# EAGLE board Embedded (EAGLE 9.2.1)
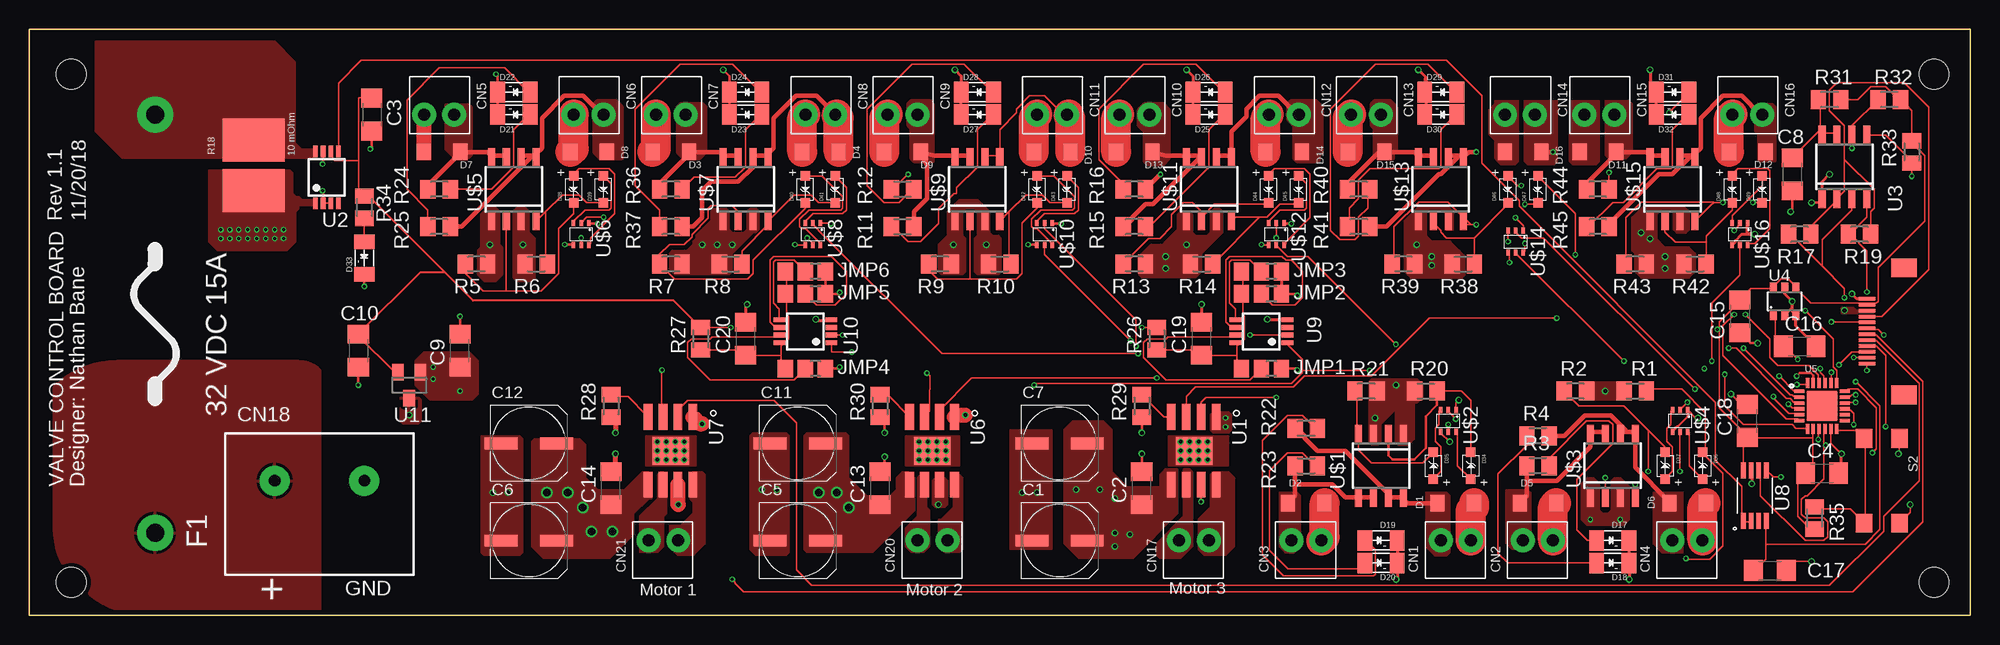
[diagram p2: board, top side]
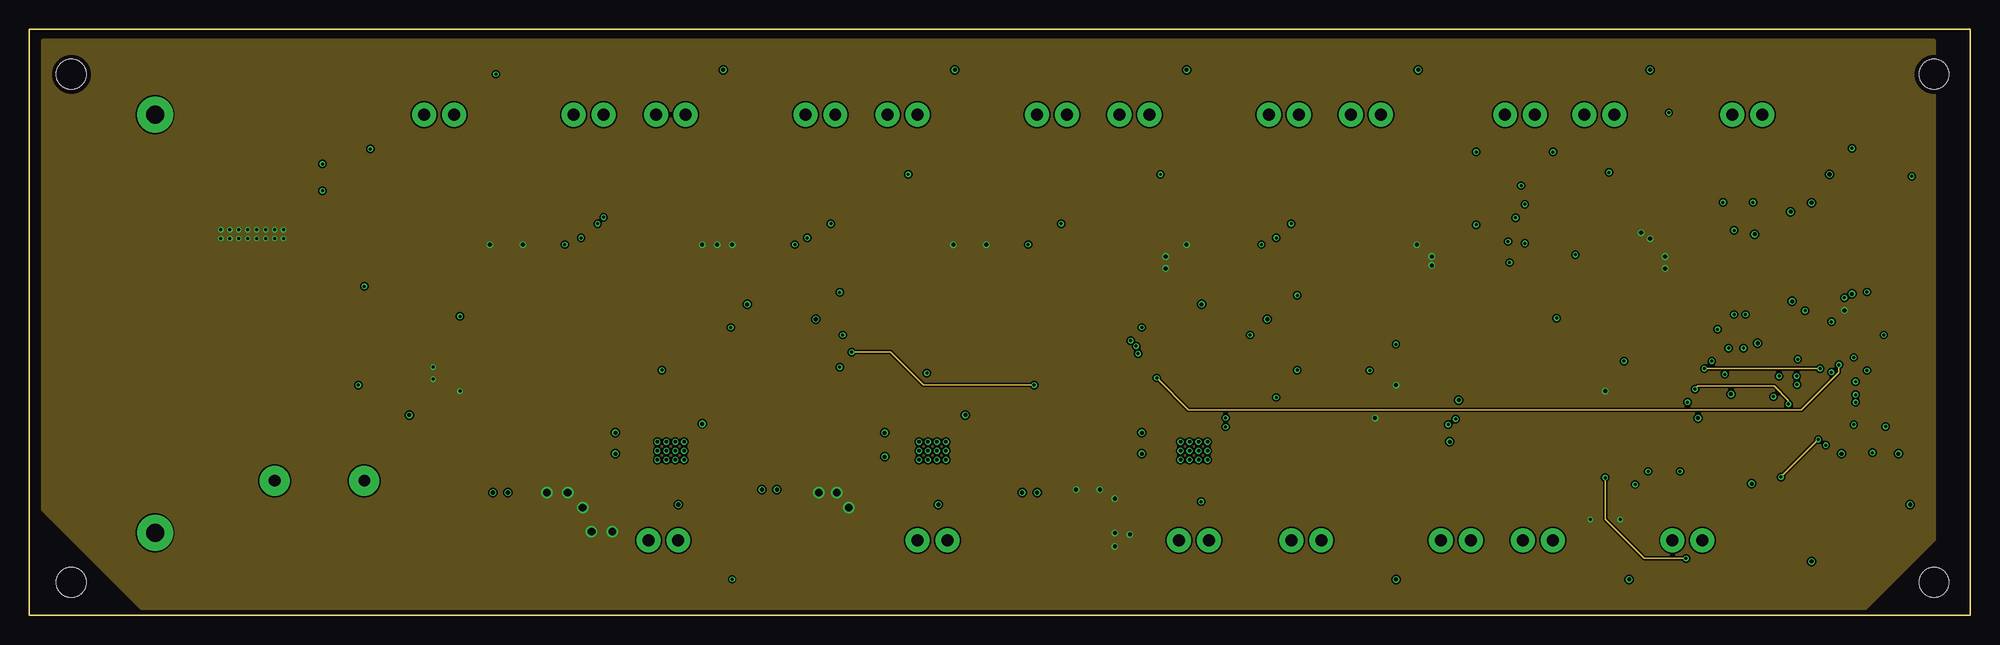
[diagram p3: board, inner layer Route2]
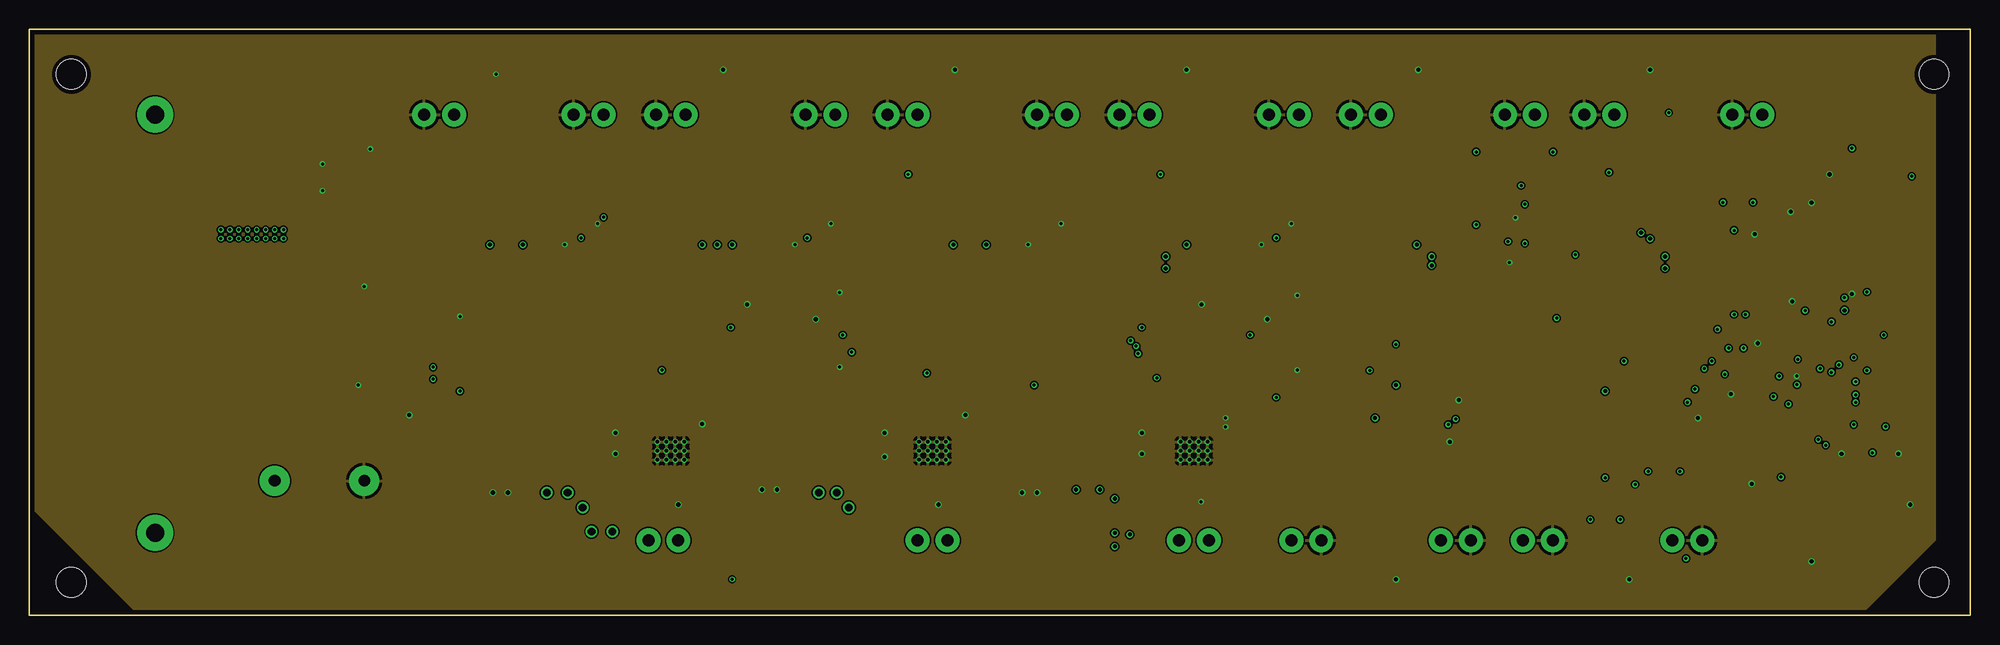
[diagram p4: board, inner layer Route15]
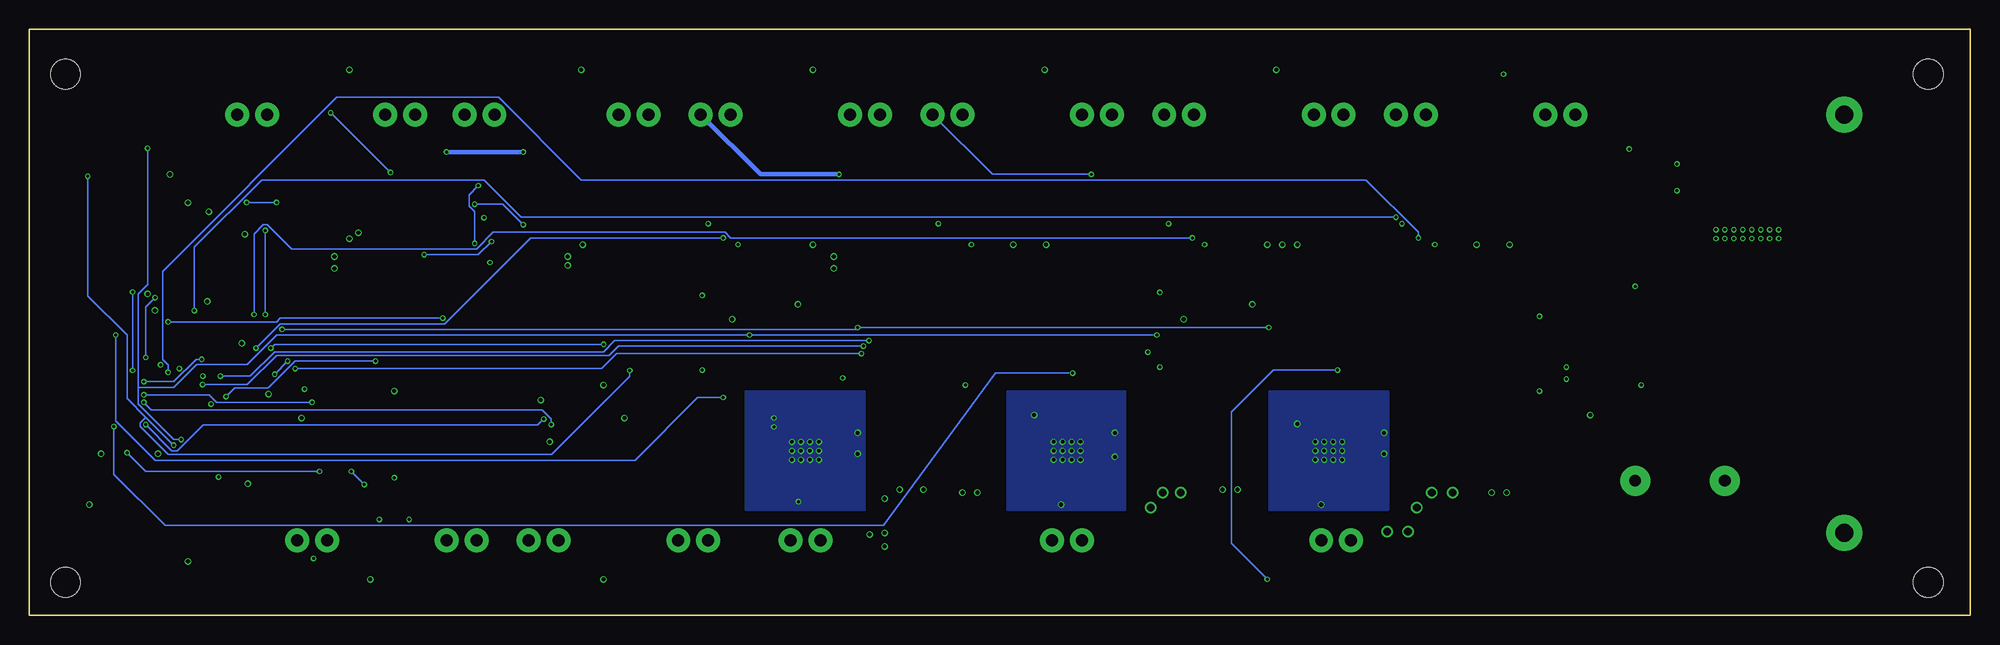
[diagram p5: board, bottom side, seen from below]

Size 164.85 x 49.78 mm. Coordinates in mm from the lower left corner, seen from the top.
Outline: 0,49.78 0,0 164.85,0 164.85,49.78 0,49.78
Copper layers (1*2*15*16): Top 0.035559375mm / dielectric 0.17018125mm / Route2 0.01778125mm / dielectric 47mil / Route15 0.01778125mm / dielectric 0.17018125mm / Bottom 0.035559375mm
Design rules "oshpark-4layer": minimum track width 5mil, minimum drill 10mil, track to track 5mil, track to pad 5mil, pad to pad 5mil, via to via 5mil, smd to smd 5mil, copper to edge 15mil, drill to drill 6mil, minimum pad ring 4mil, minimum via ring 4mil, stop-mask expansion 2.5mil, vias tented up to drill 0mil, thermal gap 10mil
Net classes: 1 GND: width 2.54 mm; 2 12V_OUT: width 2.54 mm, clearance 0.127 mm; 3 5V: width 0.127 mm, clearance 0.013 mm; 4 out: width 0.381 mm
Holes 2.5 mm at 161.8,2.79 161.8,45.97 3.56,2.79 3.56,45.97

## Footprints (pad centres in the part's own frame; a part is rotated, then mirrored left to right if it is on the bottom)
UD-6,3X7,7_NICHICON = smd 2.8 x 1: + 2.35,0; - -2.35,0
C1206 = smd 1.6 x 1.8: 1 -1.4,0; 2 1.4,0
KF2540-2 = drill 1.016 pad 2.032: P$1 0,1.27; P$2 0,-1.27
PHOEN_MKDS = drill 1 pad 2.54: P$1 -3.81,0; P$2 3.81,0
MOLEX_WM1108 = smd 0.3 x 1.4: P$1 -2.75,0; P$2 -2.25,0; P$3 -1.75,0; P$4 -1.25,0; P$5 -0.75,0; P$6 -0.25,0; P$7 0.25,0; P$8 0.75,0; P$9 1.25,0; P$10 1.75,0; P$11 2.25,0; P$12 2.75,0 | smd 1.6 x 2.2: P$13 -5.4,-3.15; P$14 5.4,-3.15
DO219 = smd 1.2 x 1.4: A$2 1.55,0; C$1 -1.55,0
1206 = smd 1.25 x 1.75: P$1 1.375,0; P$2 -1.375,0
SOD_323F = smd 0.8 x 0.8: A 1.15,0; C -1.15,0
LITTLEFUSE125_003 = drill 1.524 pad 3.048: P$1 17.78,0; P$2 -17.78,0
A0R-JMP = smd 1.5 x 1.3: 1 0,1.7; 2 0,0; 3 0,-1.7
M0805 = smd 1.3 x 1.6: 1 -0.95,0; 2 0.95,0
2818 = smd 3.65 x 5.25: P$1 -2.16,0; P$2 2.16,0
TL3305 = smd 1.6 x 1.4: P$1 -3.6,-1.5; P$2 3.6,-1.5; P$3 -3.6,1.5; P$4 3.6,1.5
SO8_EP = smd 2.4 x 3.1: GND 0,0 | smd 2.2 x 0.75: P1 -2.875,1.87; P2 -2.875,0.6; P3 -2.875,-0.67; P4 -2.875,-1.94; P5 2.876,-1.94; P6 2.875,-0.67; P7 2.875,0.6; P8 2.875,1.87 | drill 0.3 pad 0.406: P$1 -0.762,1.143; P$2 0,1.143; P$3 0.762,1.143; P$4 0.762,0.381; P$5 0,0.381; P$6 -0.762,0.381; P$7 -0.762,-0.381; P$8 0,-0.381; P$9 0.762,-0.381; P$10 0.762,-1.143; P$11 0,-1.143; P$12 -0.762,-1.143
DGK_S-PDSO-G8 = smd 0.4 x 1: 1 -0.975,-2.2; 2 -0.325,-2.2; 3 0.325,-2.2; 4 0.975,-2.2; 5 0.975,2.2; 6 0.325,2.2; 7 -0.325,2.2; 8 -0.975,2.2
SO-8 = smd 0.6 x 1.52: 1 -1.905,-2.725; 2 -0.635,-2.725; 3 0.635,-2.725; 4 1.905,-2.725; 5 1.905,2.725; 6 0.635,2.725; 7 -0.635,2.725; 8 -1.905,2.725
SOT23-6 = smd 0.6 x 0.9: 1 -0.95,-1.15; 2 0,-1.15; 3 0.95,-1.15; 4 0.95,1.15; 5 0,1.15; 6 -0.95,1.15
QFN_24_EP = smd 2.6 x 2.6: EP$1 0,0 | smd 0.85 x 0.3: P1 -1.95,1.25; P2 -1.95,0.75; P3 -1.95,0.25; P4 -1.95,-0.25; P5 -1.95,-0.75; P6 -1.95,-1.25; P13 1.95,-1.25; P14 1.95,-0.75; P15 1.95,-0.25; P16 1.95,0.25; P17 1.95,0.75; P18 1.95,1.25 | smd 0.3 x 0.85: P7 -1.25,-1.95; P8 -0.75,-1.95; P9 -0.25,-1.95; P10 0.25,-1.95; P11 0.75,-1.95; P12 1.25,-1.95; P19 1.25,1.95; P20 0.75,1.95; P21 0.25,1.95; P22 -0.25,1.95; P23 -0.75,1.95; P24 -1.25,1.95
UMAX8 = smd 1.35 x 0.4: P$1 -2.15,0.975; P$2 -2.15,0.325; P$3 -2.15,-0.325; P$4 -2.15,-0.975; P$5 2.15,-0.975; P$6 2.15,-0.325; P$7 2.15,0.325; P$8 2.15,0.975
SOT23 = smd 1 x 1.4: 1 -0.95,-1.1; 2 0.95,-1.1; 3 0,1.1
UMT6 = smd 0.5 x 0.3: 1 -0.925,0.65; 2 -0.925,0; 3 -0.925,-0.65; 4 0.925,-0.65; 5 0.925,0; 6 0.925,0.65

## Placement (x,y rotation side)
C1  47uF  [UD-6,3X7,7_NICHICON]  87.5,6.35 0 top
C2  1uF  [C1206]  94.49,10.79 90 top
C3  1uF  [C1206]  29.08,42.55 270 top
C4  1uF  [C1206]  152.27,12.06 0 top
C5  47uF  [UD-6,3X7,7_NICHICON]  65.28,6.35 0 top
C6  47uF  [UD-6,3X7,7_NICHICON]  42.42,6.35 0 top
C7  47uF  [UD-6,3X7,7_NICHICON]  87.5,14.61 0 top
C8  1uF  [C1206]  149.73,37.47 270 top
C9  1 uF  [C1206]  36.58,22.48 90 top
C10  .5 uF  [C1206]  27.94,22.48 270 top
C11  47uF  [UD-6,3X7,7_NICHICON]  65.28,14.61 0 top
C12  47uF  [UD-6,3X7,7_NICHICON]  42.42,14.61 0 top
C13  1uF  [C1206]  72.26,10.79 90 top
C14  1uF  [C1206]  49.4,10.79 90 top
C15  1uF  [C1206]  145.29,25.4 270 top
C16  .5uF  [C1206]  150.37,22.86 0 top
C17  1uF  [C1206]  147.83,3.81 0 top
C18  1uF  [C1206]  145.92,16.51 90 top
C19  1uF  [C1206]  99.57,23.5 90 top
C20  1uF  [C1206]  60.83,23.5 90 top
CN1  KF2510-2  [KF2540-2]  121.16,6.35 90 top
CN2  KF2510-2  [KF2540-2]  128.14,6.35 90 top
CN3  KF2510-2  [KF2540-2]  108.46,6.35 90 top
CN4  KF2510-2  [KF2540-2]  140.84,6.35 90 top
CN5  KF2510-2  [KF2540-2]  34.8,42.55 270 top
CN6  KF2510-2  [KF2540-2]  47.5,42.55 270 top
CN7  KF2510-2  [KF2540-2]  54.48,42.55 270 top
CN8  KF2510-2  [KF2540-2]  67.18,42.55 270 top
CN9  KF2510-2  [KF2540-2]  74.17,42.55 270 top
CN10  KF2510-2  [KF2540-2]  93.85,42.55 270 top
CN11  KF2510-2  [KF2540-2]  86.87,42.55 270 top
CN12  KF2510-2  [KF2540-2]  106.55,42.55 270 top
CN13  KF2510-2  [KF2540-2]  113.54,42.55 270 top
CN14  KF2510-2  [KF2540-2]  126.62,42.55 270 top
CN15  KF2510-2  [KF2540-2]  133.35,42.55 270 top
CN16  KF2510-2  [KF2540-2]  145.92,42.55 270 top
CN17  KF2510-2  [KF2540-2]  98.93,6.35 90 top
CN18  PHEON_MKDS_CON  [PHOEN_MKDS]  24.64,11.43 0 top
CN19  MOLEX_FPC_52892_1233  [MOLEX_WM1108]  156.08,24.13 90 top
CN20  KF2510-2  [KF2540-2]  76.71,6.35 90 top
CN21  KF2510-2  [KF2540-2]  53.85,6.35 90 top
D1  RS1AL_DIODE  [DO219]  121.16,9.53 0 top
D2  RS1AL_DIODE  [DO219]  108.46,9.53 0 top
D3  RS1AL_DIODE  [DO219]  54.48,39.37 180 top
D4  RS1AL_DIODE  [DO219]  67.18,39.37 180 top
D5  RS1AL_DIODE  [DO219]  128.14,9.53 0 top
D6  RS1AL_DIODE  [DO219]  140.84,9.53 0 top
D7  RS1AL_DIODE  [DO219]  35.05,39.37 180 top
D8  RS1AL_DIODE  [DO219]  47.5,39.37 180 top
D9  RS1AL_DIODE  [DO219]  74.17,39.37 180 top
D10  RS1AL_DIODE  [DO219]  86.87,39.37 180 top
D11  RS1AL_DIODE  [DO219]  133.22,39.37 180 top
D12  RS1AL_DIODE  [DO219]  145.92,39.37 180 top
D13  RS1AL_DIODE  [DO219]  93.85,39.37 180 top
D14  RS1AL_DIODE  [DO219]  106.55,39.37 180 top
D15  RS1AL_DIODE  [DO219]  113.54,39.37 180 top
D16  RS1AL_DIODE  [DO219]  126.87,39.37 180 top
D17  1206LED  [1206]  134.49,6.35 180 top
D18  1206LED  [1206]  134.49,4.45 180 top
D19  1206LED  [1206]  114.81,6.35 180 top
D20  1206LED  [1206]  114.81,4.45 180 top
D21  1206LED  [1206]  41.15,42.55 0 top
D22  1206LED  [1206]  41.15,44.45 0 top
D23  1206LED  [1206]  60.83,42.55 0 top
D24  1206LED  [1206]  60.83,44.45 0 top
D25  1206LED  [1206]  100.2,42.55 0 top
D26  1206LED  [1206]  100.2,44.45 0 top
D27  1206LED  [1206]  80.52,42.55 0 top
D28  1206LED  [1206]  80.52,44.45 0 top
D29  1206LED  [1206]  119.89,44.45 0 top
D30  1206LED  [1206]  119.89,42.55 0 top
D31  1206LED  [1206]  139.57,44.45 0 top
D32  1206LED  [1206]  139.57,42.55 0 top
D33  1206LED  [1206]  28.45,30.35 90 top
D34  6.2V  [SOD_323F]  122.43,12.7 270 top
D35  6.2V  [SOD_323F]  119.25,12.7 270 top
D36  6.2  [SOD_323F]  142.11,12.7 270 top
D37  6.2V  [SOD_323F]  138.94,12.7 270 top
D38  6.2V  [SOD_323F]  46.23,36.2 90 top
D39  6.2V  [SOD_323F]  48.77,36.2 90 top
D40  6.2V  [SOD_323F]  65.91,36.2 90 top
D41  6.2V  [SOD_323F]  68.45,36.2 90 top
D42  6.2V  [SOD_323F]  85.6,36.2 90 top
D43  6.2V  [SOD_323F]  88.14,36.2 90 top
D44  6.2V  [SOD_323F]  105.28,36.2 90 top
D45  6.2V  [SOD_323F]  107.82,36.2 90 top
D46  6.2V  [SOD_323F]  125.6,36.2 90 top
D47  6.2V  [SOD_323F]  128.14,36.2 90 top
D48  6.2V  [SOD_323F]  144.65,36.2 90 top
D49  6.2V  [SOD_323F]  147.19,36.2 90 top
F1  32 VDC 15A  [LITTLEFUSE125_003]  10.67,24.77 90 top
JMP1  0R-JUMPA  [A0R-JMP]  104.65,20.95 270 top
JMP2  0R-JUMPA  [A0R-JMP]  104.65,27.3 270 top
JMP3  0R-JUMPA  [A0R-JMP]  104.65,29.21 270 top
JMP4  0R-JUMPA  [A0R-JMP]  65.91,20.95 270 top
JMP5  0R-JUMPA  [A0R-JMP]  65.91,27.3 270 top
JMP6  0R-JUMPA  [A0R-JMP]  65.91,29.21 270 top
R1  5k  [M0805]  136.4,19.05 180 top
R2  5k  [M0805]  131.32,19.05 0 top
R3  5k  [M0805]  128.14,12.7 0 top
R4  5k  [M0805]  128.14,15.24 0 top
R5  5k  [M0805]  37.97,29.84 0 top
R6  1k  [M0805]  43.05,29.84 180 top
R7  5k  [M0805]  54.48,29.84 0 top
R8  5k  [M0805]  59.56,29.84 180 top
R9  5k  [M0805]  77.34,29.84 0 top
R10  5k  [M0805]  82.42,29.84 180 top
R11  5k  [M0805]  74.17,33.02 180 top
R12  5k  [M0805]  74.17,36.2 180 top
R13  5k  [M0805]  93.85,29.84 0 top
R14  5k  [M0805]  99.57,29.84 180 top
R15  5k  [M0805]  93.85,33.02 0 top
R16  5k  [M0805]  93.85,36.2 0 top
R17  10k  [M0805]  150.37,32.38 0 top
R18  10 mOhm  [2818]  19.05,38.23 90 top
R19  10k  [M0805]  155.45,32.38 0 top
R20  5k  [M0805]  118.62,19.05 180 top
R21  5k  [M0805]  113.54,19.05 0 top
R22  5k  [M0805]  108.46,15.88 0 top
R23  5k  [M0805]  108.46,12.7 180 top
R24  5k  [M0805]  34.8,36.2 0 top
R25  5k  [M0805]  34.8,33.02 0 top
R26  200  [M0805]  95.76,23.5 90 top
R27  200  [M0805]  57.02,23.5 90 top
R28  18k  [M0805]  49.4,17.78 90 top
R29  18k  [M0805]  94.49,17.78 90 top
R30  18k  [M0805]  72.26,17.78 90 top
R31  200k  [M0805]  152.91,43.81 0 top
R32  10k  [M0805]  157.99,43.81 0 top
R33  10k  [M0805]  159.89,39.37 90 top
R34  200  [M0805]  28.45,34.67 90 top
R35  10k  [M0805]  151.64,8.26 270 top
R36  5k  [M0805]  54.48,36.2 0 top
R37  5k  [M0805]  54.48,33.02 0 top
R38  5k  [M0805]  121.79,29.84 180 top
R39  5k  [M0805]  116.71,29.84 0 top
R40  5k  [M0805]  112.9,36.2 0 top
R41  5k  [M0805]  112.9,33.02 0 top
R42  5k  [M0805]  141.48,29.84 180 top
R43  5k  [M0805]  136.4,29.84 0 top
R44  5k  [M0805]  133.22,36.2 0 top
R45  5k  [M0805]  133.22,33.02 0 top
S2  TL3305  [TL3305]  157.35,11.43 90 top
U1  DRV8871  [SO8_EP]  98.93,13.97 270 top
U2  AD8418BZR  [DGK_S-PDSO-G8]  25.27,37.21 0 top
U3  GTL2002  [SO-8]  154.18,38.1 0 top
U4  MCP1501T-40E/CHY  [SOT23-6]  149.1,26.67 0 top
U5  MCP23018  [QFN_24_EP]  152.27,17.78 0 top
U6  DRV8871  [SO8_EP]  76.71,13.97 270 top
U7  DRV8871  [SO8_EP]  54.48,13.97 270 top
U8  MAX11645UMAX8  [UMAX8]  146.56,10.16 90 top
U9  TCN75A  [DGK_S-PDSO-G8]  104.65,24.13 90 top
U10  TCN75A  [DGK_S-PDSO-G8]  65.91,24.13 90 top
U11  RT9058-50GV  [SOT23]  32.26,19.56 180 top
U$1  IRF9953PBF  [SO-8]  114.81,12.7 180 top
U$2  UM6K31N  [UMT6]  120.52,16.51 270 top
U$3  IRF9953PBF  [SO-8]  134.49,12.7 0 top
U$4  UM6K31N  [UMT6]  140.21,16.51 270 top
U$5  IRF9953PBF  [SO-8]  41.15,36.2 0 top
U$6  UM6K31N  [UMT6]  46.86,32.38 270 top
U$7  IRF9953PBF  [SO-8]  60.83,36.2 0 top
U$8  UM6K31N  [UMT6]  66.55,32.38 270 top
U$9  IRF9953PBF  [SO-8]  80.52,36.2 0 top
U$10  UM6K31N  [UMT6]  86.23,32.38 270 top
U$11  IRF9953PBF  [SO-8]  100.2,36.2 0 top
U$12  UM6K31N  [UMT6]  105.92,32.38 270 top
U$13  IRF9953PBF  [SO-8]  119.89,36.2 0 top
U$14  UM6K31N  [UMT6]  126.24,31.75 270 top
U$15  IRF9953PBF  [SO-8]  139.57,36.2 0 top
U$16  UM6K31N  [UMT6]  145.29,32.38 270 top

## Tracks (layer width: path | path; a pad name or v marks a point on that pad's centre or on a via)
3.3V
  Top 0.127: 154.18,38.73 154.18,36.04 153.54,35.4 U3.2 153.54,35.24 151.32,33.02 R17.2 | 154.18,38.73 154.18,41.59 152.91,42.86 152.91,44.61 153.54,45.24 159.26,45.24 161.32,43.18 161.32,29.37 157.35,25.4 156.08,25.4 CN19.P$9 | 154.18,38.73 156.72,36.2 156.72,34.61 156.4,34.29 R19.2
4.096V  (via drill 0.25)
  Top 0.127: U4.1 148.3,25.4 148.3,23.5 148.94,22.86 C16.1 149.1,22.86 v150.21,21.75 | 147.51,6.03 147.51,4.76 146.56,3.81 C17.1 | 147.51,6.03 147.51,7.94 U8.P$4 | v155.13,19.84 157.19,17.78 157.19,7.3 155.92,6.03 147.51,6.03
  Bottom 0.127: v150.21,21.75 150.69,21.75 152.59,19.84 v155.13,19.84
5V  (via drill 0.25)
  Top 0.127: 145.92,15.08 145.6,14.76 145.6,12.38 U8.P$8 | 151.48,15.08 151.48,12.54 151,12.06 C4.1 150.84,12.06 150.21,11.43 150.21,8.41 151.16,7.46 151.64,7.46 R35.2 | 151.48,15.08 151.48,15.72 U5.P8 | 151.48,15.08 145.92,15.08 | 145.92,15.08 C18.1 145.92,15.24 143.54,17.62 143.54,24.29 | R31.2 155.29,43.81 156.4,44.93 157.67,44.93 158.78,43.81 R32.2 159.89,42.86 R33.2 159.89,40.16 161,39.05 161,33.5 157.03,29.53 157.03,26.67 156.88,26.51 156.08,26.51 | 156.08,26.51 151.32,26.51 150.05,27.78 U4.4 149.89,27.94 149.89,28.1 149.41,28.57 148.78,28.57 148.15,27.94 U4.6 148.15,27.78 146.24,27.78 145.29,26.83 C15.1 145.29,26.67 143.54,24.92 143.54,24.29 | 156.08,26.51 CN19.P$11 | C10.1 27.94,23.75 31.03,20.66 U11.2 | 27.97,38.64 25.91,38.64 25.75,38.8 25.75,39.27 U2.6 | C3.1 29.08,43.97 27.97,43.97 27.97,38.64 | 37.69,26.73 35.26,29.16 28.8,35.62 R34.2 27.97,36.1 27.97,38.64 | v94.49,24.45 R26.2 | v59.56,24.45 R27.2 | v143.38,24.29 143.54,24.29
  Top 0.152: C10.1 33.22,29.16 35.26,29.16 | R27.2 54.73,26.73 37.69,26.73
  Bottom 0.127: v59.56,24.45 v94.49,24.45 94.65,24.29 v143.38,24.29
12V_OUT  (via drill 0.25, 0.35, 0.65)
  other vias: 39.12,31.5 41.91,31.5 57.15,31.5 58.42,31.5 59.69,31.5 78.49,31.5 81.28,31.5 96.52,29.46 96.52,30.48 98.3,31.5 117.86,31.5 119.13,30.48 119.13,29.72 136.91,32.51 137.67,32 138.94,30.48 138.94,29.46 133.86,19.05 116.08,19.56 114.3,16.76 88.9,10.67 90.93,10.67 92.2,9.91 92.2,6.99 92.2,5.84 93.47,6.86 154.18,25.91 16.26,32.77 17.02,32.77 17.78,32.77 16.26,32 17.02,32 17.78,32 18.54,32.77 18.54,32 19.3,32.77 19.3,32 20.07,32 20.07,32.77 20.83,32.77 20.83,32 21.59,32 21.59,32.77 67.06,10.41 68.58,10.41 69.6,9.14 43.94,10.41 45.72,10.41 46.99,9.14 47.75,7.11 49.53,7.11 132.59,8.13 135.13,8.13 34.29,20.07 36.58,19.05 34.29,21.08
  pour Route2: 1.14,48.9 161.8,48.9 161.8,6.35 155.96,0.51 9.53,0.51 1.14,8.89
  pour Top (no thermals): 41.15,34.04 41.15,29.21 41.15,28.7 41.4,28.45 42.67,28.45 42.93,28.7 42.93,30.99 42.93,32 42.42,32.51 42.42,34.29 42.16,34.54 41.66,34.54 41.4,34.54 41.15,34.29
  pour Top (no thermals): 38.35,33.78 38.35,31.24 38.1,30.99 38.1,28.96 38.35,28.7 38.61,28.45 39.62,28.45 40.13,28.96 40.13,31.24 39.88,31.5 39.88,34.29 39.62,34.54 39.37,34.54 38.86,34.54 38.61,34.29 38.35,34.04
  pour Top (no thermals): 58.93,34.54 58.17,34.54 57.91,34.29 57.91,34.04 57.91,33.53 56.9,32.51 56.64,32.26 56.64,32 56.39,31.75 56.39,31.5 55.88,30.99 54.61,30.99 54.36,30.73 54.36,29.46 54.86,28.96 59.44,28.96 59.69,29.21 59.69,29.46 59.69,30.73 61.47,32.51 61.72,32.51 61.98,32.77 61.98,33.53 61.98,34.29 61.72,34.54 61.21,34.54 60.96,34.29 60.96,32.77 60.71,32.51 60.2,32.51 59.69,32.51 59.44,32.77 59.44,34.29 59.18,34.54
  pour Top (no thermals): 77.22,29.97 77.22,29.21 77.47,28.96 79.25,28.96 79.5,29.21 79.5,29.46 79.5,32 79.25,32.26 79.25,34.04 79.25,34.29 79.5,34.54 80.26,34.54 80.52,34.29 80.52,32.26 80.26,32 80.26,29.72 80.26,29.46 80.26,29.21 80.52,28.96 82.3,28.96 82.55,29.21 82.55,32 82.3,32.26 81.79,32.26 81.53,32.51 81.53,34.29 80.52,35.31 80.26,35.31 78.99,35.31 77.98,34.29 77.98,32.26 77.72,32 77.22,31.5
  pour Top (no thermals): 97.79,34.29 97.54,34.04 97.54,32.77 96.52,31.75 96.27,31.5 96.01,31.5 95.25,31.5 94.23,30.48 94.23,29.21 94.23,28.96 94.49,28.7 98.81,28.7 99.06,28.7 99.57,29.21 99.57,30.73 101.35,32.51 101.35,34.29 101.09,34.54 100.84,34.54 100.58,34.54 100.33,34.29 100.33,32.51 100.08,32.26 99.06,32.26 98.81,32.51 98.81,34.04 98.55,34.29
  pour Top (no thermals): 118.11,34.8 116.84,33.53 116.84,30.23 116.84,29.21 117.09,28.96 117.35,28.7 121.67,28.7 121.92,28.96 121.92,29.97 121.92,30.48 121.41,30.99 120.65,31.75 119.13,31.75 118.62,32.26 118.62,32.51 118.62,34.29 118.87,34.54 119.89,34.54 120.4,34.04 120.4,32.77 120.9,32.77 120.9,34.29 120.4,34.8
  pour Top (no thermals): 137.16,34.8 136.14,33.78 136.14,30.99 136.4,30.73 136.4,29.21 136.91,28.7 140.97,28.7 141.48,29.21 141.48,29.72 141.48,30.73 140.97,31.24 140.72,31.24 138.94,31.24 138.18,32 138.18,33.53 138.18,34.04 138.43,34.29 138.68,34.54 139.45,34.54 139.7,34.29 139.7,34.04 139.7,32.77 139.95,32.51 140.72,32.51 140.97,32.77 140.97,34.29 140.46,34.8 139.95,34.8
  pour Top (no thermals): 132.08,19.81 132.08,18.29 135.64,18.29 135.64,19.81
  pour Top (no thermals): 113.79,19.81 113.79,14.99 113.79,14.73 114.05,14.48 114.55,14.48 114.81,14.73 114.81,16.26 115.57,17.02 116.59,18.03 117.35,18.03 117.86,18.03 118.36,18.54 118.36,19.56 117.86,20.07 114.3,20.07 114.05,20.07
  pour Top (no thermals): 87.88,15.75 87.88,6.1 89.15,4.83 93.73,4.83 97.54,8.64 97.54,10.41 97.03,10.92 93.22,10.92 91.95,12.19 91.95,15.75 91.19,16.51 88.65,16.51
  pour Top (no thermals): 96.01,11.18 96.01,11.94 96.27,12.19 96.52,12.45 97.54,12.45 97.54,10.41 96.52,10.41 96.01,10.92
  pour Top (no thermals): 156.72,25.65 153.92,25.65 153.92,26.16 154.94,26.16 155.19,25.91 156.72,25.91
  pour Top (no thermals): 69.34,15.49 66.04,15.49 65.79,15.24 65.79,5.59 66.04,5.33 71.63,5.33 75.18,8.89 75.18,11.68 74.68,12.19 74.17,12.19 73.66,11.68 73.66,10.67 73.15,10.16 71.12,10.16 69.6,11.68 69.6,15.24
  pour Top (no thermals): 42.93,14.99 42.67,14.73 42.67,5.84 43.69,4.83 44.7,4.83 49.28,4.83 50.29,5.84 51.31,6.86 51.31,8.64 52.58,9.91 52.83,9.91 52.83,11.94 52.58,12.19 52.07,12.19 50.55,10.67 50.29,10.67 48.26,10.67 47.5,11.43 47.24,11.68 47.24,14.48 46.74,14.99
  pour Top (no thermals): 132.33,11.68 131.83,11.18 131.83,10.92 131.83,8.13 132.33,7.62 135.38,7.62 135.89,8.13 135.89,10.92 135.13,11.68 134.62,11.68 134.37,11.43 134.37,8.89 134.11,8.64 133.86,8.64 133.6,8.64 133.35,8.89 133.35,11.18 132.84,11.68
  pour Top (no thermals): 116.08,14.73 116.33,14.48 116.59,14.48 117.09,14.48 117.35,14.73 117.6,14.99 117.6,18.03 116.33,18.03 116.08,17.78
  pour Top (no thermals): 32.77,19.56 32.77,21.59 33.53,22.35 37.34,22.35 38.1,21.59 38.1,18.8 37.59,18.29 34.04,18.29
  pour Top (no thermals): 15.24,37.85 15.24,31.75 16,30.99 21.84,30.99 22.61,31.75 22.61,34.29 22.86,34.54 22.86,34.8 24.38,34.8 24.38,35.31 23.11,35.31 22.86,35.56 22.61,35.56 22.35,35.81 22.35,37.59 22.1,37.85
+12V
  pour Top (no thermals): 5.59,48.77 5.59,41.15 7.87,38.86 24.36,38.86 24.36,39.62 23.09,39.62 22.58,40.13 22.58,47.02 20.83,48.77
BD1  (via drill 0.25)
  Top 0.127: v153.7,21.27 154.81,22.38 CN19.P$3 | v95.76,20.16 80.04,20.16 77.34,17.46 77.34,16.99 U6.P2
  Route2 0.127: v153.7,21.27 153.7,20.64 150.53,17.46 98.46,17.46 v95.76,20.16
BD2  (via drill 0.25)
  Top 0.127: v157.67,16.03 157.67,22.07 156.88,22.86 156.08,22.86 CN19.P$4 | v76.23,20.57 76.49,20.32 76.46,18 76.45,18 76.45,17.37 76.07,16.99 U6.P3
  Bottom 0.127: v157.67,16.03 157.67,11.97 153.32,7.62 92.29,7.62 82.78,20.57 v76.23,20.57
BD3
  Top 0.127: CN19.P$5 156.08,23.34 156.88,23.34 160.53,19.68 160.53,11.43 157.51,8.41 157.51,7.14 152.91,2.54 66.45,2.54 65.15,3.84 65.15,16.35 63.25,18.26 55.91,18.26 55.12,17.46 55.12,16.99 U7.P2
BD4  (via drill 0.25)
  Top 0.127: CN19.P$6 156.08,23.81 156.88,23.81 160.84,19.84 160.84,7.94 154.88,1.97 60.67,1.97 59.94,2.7 59.94,2.79 v59.69,3.05 | U7.P3 53.69,16.99 53.69,17.02 53.69,17.46 53.69,20.8 v53.72,20.83
  Bottom 0.127: v53.72,20.83 59.18,20.83 62.74,17.27 62.74,6.1 v59.69,3.05
BD5  (via drill 0.25)
  Top 0.127: v157.51,23.81 157.03,24.29 156.08,24.29 CN19.P$7 | v105.92,18.51 99.95,18.51 99.53,18.09 U1.P2
  Bottom 0.127: v157.51,23.81 157.51,16.51 154.18,13.18 113.41,13.18 108.08,18.51 v105.92,18.51
BD6  (via drill 0.25)
  Top 0.127: v153.07,24.92 156.08,24.92 CN19.P$8 | v129.73,25.24 118.94,25.24 114.01,20.32 108.3,20.32 107.38,19.4 99.06,19.4 98.26,18.6 U1.P3
  Bottom 0.127: v153.07,24.92 143.86,24.92 143.54,25.24 v129.73,25.24
GND  (via drill 0.25, 0.35)
  Top 0.127: U$2.1 121.17,18.05 v121.41,18.29 | U$2.4 119.87,15.51 v120.65,14.73 | v153.92,13.72 153.02,14.62 U5.P11 | C17.2 149.99,4.57 v151.38,4.57 | S2.P$1 159.77,8.74 v159.77,9.4 | v158.75,13.72 158.85,13.82 S2.P$2 | 151.62,19.98 151.62,19.82 U5.P23 | v126.24,33.78 126.89,33.13 U$14.1 | U$14.4 125.73,30.68 v125.73,29.97 | v65.02,31.5 65.06,31.46 U$8.4 | v68.07,33.27 68.04,33.31 U$8.1 | v104.65,31.5 104.68,31.46 U$12.4 | 118.62,45.72 118.51,45.62 D29.P$2 | U2.3 U2.2
  Top 0.203: v94.49,15.49 R29.1 | v94.49,13.72 C2.2 | C13.2 72.64,12.58 v72.64,13.46 | v72.64,15.49 72.64,16.45 R30.1 | v68.83,27.43 68.71,27.3 JMP5.1 JMP6.1 | v68.83,21.08 68.71,20.95 JMP4.1 | v107.7,27.18 107.57,27.3 JMP2.1 | v107.7,20.83 107.57,20.95 JMP1.1 | U$12.1 106.6,33.27 v107.19,33.27 | U$10.1 86.92,33.27 v87.63,33.27 | U$10.4 85.55,31.5 v84.84,31.5 | U$6.1 47.55,33.27 v48.26,33.27 | U$6.4 46.18,31.5 v45.47,31.5 | C10.2 v27.94,19.56 | C9.2 v36.58,25.4 | D33.P$2 v28.45,27.94 | D21.P$2 D22.P$2 39.77,45.83 v39.62,45.97 | D23.P$2 D24.P$2 59.46,45.83 v58.93,46.35 | U2.7 24.95,38.41 v24.89,38.35 | U2.2 24.95,36.01 v24.89,36.07 | C3.2 29.08,39.75 v28.96,39.62 | C8.2 149.73,34.42 v149.61,34.29 | v151.38,35.05 151.95,35.05 U3.1 | C18.2 145.41,17.91 v144.53,18.8 | v146.81,23.11 146.17,23.11 C15.2 | v141.73,16.76 141.53,16.76 140.87,17.42 | 140.87,17.42 U$4.1 | 140.87,17.42 140.87,16.89 140.04,16.06 139.96,16.06 139.83,15.93 139.83,15.86 U$4.4 | D25.P$2 98.83,44.96 | U1.P7 v99.53,9.64 | v150.11,20.32 150.37,20.57 151.33,20.57 151.52,20.38 U5.P23
  Top 0.254: D27.P$2 D28.P$2 79.14,45.83 v78.61,46.35 | v98.3,46.35 98.83,45.83 98.83,44.96 D26.P$2 | v117.98,46.35 118.62,45.72 118.62,42.65 D30.P$2 | v137.67,46.35 137.67,44.98 D31.P$2 D32.P$2 | U3.1 152.27,36.83 v152.91,37.47 | U$16.4 144.88,31.71 144.88,31.82 145.45,32.38 v146.56,32.38 145.94,32.38 U$16.1 | U4.2 149.73,26.16 v149.73,26.67 | v149.73,26.67 149.73,25.84 U4.3 150.05,24.58 C16.2 | v149.73,26.67 149.1,27.3 U4.5 | CN19.P$12 155.24,26.88 v154.81,27.3 | U8.P$7 146.3,12.29 v146.3,11.18 | C4.2 153.92,12.32 v153.92,13.72 | D17.P$2 D18.P$2 135.89,4.42 v135.89,3.05 | v116.08,3.05 116.18,3.15 D20.P$2 D19.P$2 | U9.4 105.2,25.11 v105.16,25.15 | JMP3.1 JMP2.1 | v99.57,26.42 C19.2 | v66.8,25.15 66.93,25.02 68.03,25.02 U10.4 | v60.96,26.42 60.83,26.29 C20.2
  Top 0.406: C14.2 49.78,12.58 v49.78,13.72 | R28.1 49.78,16.45 v49.78,15.49
  Top 1.27: U6.P1 78.75,17.02 v79.5,17.02 | v55.12,9.4 55.08,9.43 U7.P7 | U7.P1 56.94,16.26 v57.15,16.26 | D7.A$2 33.53,39.4 CN5.P$2
  Top 2.54: D8.A$2 46.23,39.65 CN6.P$2 | D3.A$2 53.21,39.65 CN7.P$2 | D4.A$2 65.63,42.27 CN8.P$2 | D9.A$2 72.62,42.27 CN9.P$2 | D10.A$2 85.32,42.27 CN11.P$2 | D13.A$2 92.3,42.27 CN10.P$2 | D14.A$2 105,42.27 CN12.P$2 | D15.A$2 111.99,42.27 CN13.P$2 | D12.A$2 144.37,42.27 CN16.P$2 | CN4.P$2 142.11,9.24 D6.A$2 | CN2.P$2 129.41,9.24 D5.A$2 | CN1.P$2 122.43,8.89 122.71,9.17 D1.A$2 | CN3.P$2 110.01,6.63 D2.A$2
  other vias: 39.37,10.41 40.64,10.41 62.23,10.67 63.5,10.67 84.33,10.41 85.6,10.41 77.22,9.4 101.6,16.76 101.6,16 32.26,17.02
  pour Route15: 0.51,49.53 161.8,49.53 161.8,6.35 155.96,0.51 8.89,0.51 0.51,8.89
  pour Top (no thermals): 100.33,15.75 100.58,15.49 101.85,15.49 102.11,15.75 102.11,16.76 102.11,17.02 101.85,17.27 100.58,17.27 100.33,17.02
  pour Top (no thermals): 83.31,15.75 83.31,5.59 86.87,5.59 86.87,15.75
  pour Top (no thermals): 61.47,15.49 61.21,15.24 61.21,5.59 61.72,5.08 62.48,5.08 64.26,5.08 64.52,5.33 64.52,15.24 64.26,15.49 63.75,15.49
  pour Top (no thermals): 38.35,15.24 38.35,5.33 38.61,5.08 41.66,5.08 41.91,5.33 41.91,14.99 41.66,15.24
  pour Top (no thermals): 76.96,11.68 76.71,11.43 76.71,9.65 76.71,9.4 76.96,9.14 77.72,9.14 77.98,9.4 77.98,10.41 77.98,11.43 77.72,11.68
  pour Top (no thermals): 74.42,15.24 78.99,15.24 78.99,12.7 74.42,12.7
  pour Top (no thermals): 101.85,15.24 96.77,15.24 96.77,12.7 101.85,12.7
  pour Top (no thermals): 52.32,15.24 56.64,15.24 56.64,12.7 52.32,12.7
  pour Top (no thermals): 124.46,43.69 124.46,43.43 123.95,42.93 123.95,40.89 124.46,40.39 124.46,38.86 124.71,38.61 124.97,38.35 126.24,38.35 126.49,38.61 126.49,40.13 126.49,43.69
  pour Top (no thermals): 132.08,43.69 130.81,43.69 130.81,38.61 131.06,38.35 133.1,38.35 133.35,38.61 133.35,43.69
  pour Top: 31.5,18.54 31.5,16.51 31.75,16.26 33.02,16.26 33.27,16.51 33.27,16.76 33.27,18.29 33.02,18.54
  pour Bottom (isolate 0.254, no thermals): 59.56,19.05 59.56,8.89 49.4,8.89 49.4,19.05
  pour Bottom (isolate 0.254, no thermals): 81.79,19.05 81.79,8.89 71.76,8.89 71.76,19.05
  pour Bottom (isolate 0.254, no thermals): 104.01,19.05 104.01,8.89 93.85,8.89 93.85,19.05
IOUT
  Top 0.127: U2.5 26.25,45.23 28.16,47.15 120.36,47.15 123.38,44.13 123.38,38.42 126.56,35.24 126.56,34.77 143.22,18.1 143.22,13.18 145.45,10.95 145.45,8.1 U8.P$1 145.6,7.94 146.08,7.94 U8.P$2
KLJL
  Top 0.127: 152.27,40.96 153.54,40.96 U3.7 | 152.11,41.27 152.11,41.12 152.27,40.96 | 152.11,41.27 152.11,43.81 R31.1 | 152.27,40.96 U3.8 152.11,41.27 | 152.11,41.27 149.73,38.89 C8.1
MC1  (via drill 0.25)
  Top 0.127: v121.16,16.67 120.52,17.3 U$2.2 | v154.97,16.19 154.97,17.14 154.65,17.46 154.34,17.46 U5.P15
  Bottom 0.127: v121.16,16.67 121.67,16.16 150.08,16.16 152.27,13.97 152.75,13.97 v154.97,16.19
MC2  (via drill 0.25)
  Top 0.127: v120.52,16.19 U$2.5 | v155.13,18.1 154.34,18.1 U5.P16
  Bottom 0.127: v120.52,16.19 120.52,16.67 121.32,17.46 154.5,17.46 v155.13,18.1
MC3  (via drill 0.25)
  Top 0.127: v140.84,18.1 140.21,17.46 U$4.2 | v155.13,18.73 154.81,18.73 154.65,18.57 154.34,18.57 U5.P17
  Bottom 0.127: v140.84,18.1 148.94,18.1 149.57,18.73 v155.13,18.73
MC4  (via drill 0.25)
  Top 0.127: v140.21,12.22 U$4.5 | v156.56,13.81 156.88,14.13 156.88,17.62 155.29,19.21 154.5,19.21 154.34,19.05 U5.P18
  Bottom 0.127: v140.21,12.22 154.97,12.22 v156.56,13.81
MC5  (via drill 0.25)
  Top 0.127: v48.77,33.81 47.34,33.81 46.86,33.34 U$6.2 | v150.84,25.88 153.22,23.5 153.22,21.11 153.54,20.8 153.54,19.84 U5.P19
  Bottom 0.127: v48.77,33.81 123.06,33.81 126.24,36.99 145.13,36.99 150.84,31.27 v150.84,25.88
MC6  (via drill 0.25)
  Top 0.127: v46.86,32.07 U$6.5 | v153.07,20.64 153.07,19.84 U5.P20
  Bottom 0.127: v46.86,32.07 46.86,32.54 51.31,36.99 117.98,36.99 125,44.01 138.75,44.01 153.54,29.21 153.54,21.75 153.07,21.27 v153.07,20.64
MC7  (via drill 0.25)
  Top 0.127: v94.17,22.23 77.5,22.23 67.52,32.21 66.55,33.18 U$8.2 | v152.11,20.95 152.11,20.64 152.43,20.32 152.43,19.84 U5.P21
  Route2 0.127: v152.11,20.95 v142.27,20.95
  Bottom 0.127: v94.17,22.23 114.97,22.23 116.24,20.95 v142.27,20.95
MC8  (via drill 0.25)
  Top 0.127: v66.07,32.07 66.55,31.59 U$8.5 | v145.76,25.56 147.83,23.5 147.83,21.91 148.5,21.24 151.13,21.24 151.96,20.41 151.96,19.84 U5.P22
  Bottom 0.127: v66.07,32.07 105.28,32.07 105.76,32.54 125.44,32.54 126.87,31.11 142.59,31.11 144.65,33.18 144.97,33.18 145.76,32.38 v145.76,25.56
MC9  (via drill 0.25)
  Top 0.127: U$10.2 86.23,32.86 94.01,25.08 v94.01,22.86 | U5.P24 150.88,19.59 v150.15,19.59
  Bottom 0.127: v94.01,22.86 114.81,22.86 115.6,22.07 143.86,22.07 146.34,19.59 v150.15,19.59
MC10  (via drill 0.25)
  Top 0.127: U$10.5 86.23,30.64 v93.54,23.34 | v148.62,20.32 149.89,19.05 150.21,19.05 U5.P1
  Bottom 0.127: v93.54,23.34 115.12,23.34 116.08,22.38 144.02,22.38 146.08,20.32 v148.62,20.32
MC11  (via drill 0.25)
  Top 0.127: v105.92,32.07 U$12.2 | v145.6,22.7 149.57,18.73 149.73,18.73 149.89,18.57 150.21,18.57 U5.P2
  Bottom 0.127: v105.92,32.07 122.27,32.07 129.57,24.77 143.54,24.77 v145.6,22.7
MC12  (via drill 0.25)
  Top 0.127: v116.08,23.02 108.62,30.48 106.87,30.48 105.92,31.43 U$12.5 | v144.34,22.7 144.97,22.7 149.26,18.41 149.57,18.41 149.89,18.1 150.21,18.1 U5.P3
  Bottom 0.127: v116.08,23.02 144.02,23.02 v144.34,22.7
MC13  (via drill 0.25)
  Top 0.127: v141.48,19.21 128.62,32.07 126.71,32.07 126.24,32.54 U$14.2 | v149.41,17.94 149.73,17.62 150.21,17.62 U5.P4
  Route2 0.127: v141.48,19.21 141.73,19.46 148.21,19.46 149.41,18.26 v149.41,17.94
MC14  (via drill 0.25)
  Top 0.127: v135.44,21.59 126.24,30.8 U$14.5 | v148.15,18.57 148.15,18.45 149.45,17.14 150.21,17.14 U5.P5
  Bottom 0.127: v135.44,21.59 142.27,21.59 144.56,19.3 147.41,19.3 v148.15,18.57
MC15  (via drill 0.25)
  Top 0.127: v144.81,32.7 145.29,33.18 U$16.2 | v144.81,25.56 143.86,24.61 143.86,22.07 149.26,16.67 150.21,16.67 U5.P6
  Bottom 0.127: v144.81,25.56 v144.81,32.7
MC16  (via drill 0.25)
  Top 0.127: U$16.5 145.29,28.89 142.91,26.51 v142.91,21.59 | v144.02,20.48 144.02,17.78 145.6,16.19 149.73,16.19 150.05,15.88 151,15.88 U5.P7
  Bottom 0.127: v144.02,20.48 v142.91,21.59
N$1
  Top 0.127: D35.C 118.36,12.95 114.01,12.95 112.9,14.06 U$1.4 112.9,15.56 112.74,15.72 112.74,19.05 R21.1
N$2
  Top 0.127: U$2.3 119.73,17.3 119.73,16.19 119.41,15.88 119.41,14.76 119.89,14.29 119.89,12.22 119.25,11.59 D35.A
N$3
  Top 0.127: 94.49,18.57 R29.2 96.37,16.84 U1.P4
N$4  (via drill 0.25)
  Top 0.127: D37.C 138.94,14.29 137.51,15.72 | 137.51,15.72 135.44,17.78 131.63,17.78 R2.1 | v136.4,11.11 U$3.4 | 137.51,15.72 v137.51,12.22
  Bottom 0.127: v137.51,12.22 v136.4,11.11
N$5
  Top 0.127: U$6.3 46.23,33.34 46.23,33.5 47.18,34.45 49.24,34.45 49.4,34.61 49.4,36.67 48.77,37.31 D39.A
N$6
  Top 0.127: 43.85,34.29 43.05,33.5 U$5.4 | 43.85,34.29 45.28,35.72 46.7,35.72 47.34,35.08 48.77,35.08 D39.C | 43.85,34.29 43.85,29.84 R6.1
N$7
  Top 0.127: U$8.6 67.18,31.59 65.91,32.86 65.6,32.86 65.44,33.02 65.44,33.66 66.23,34.45 68.93,34.45 69.09,34.61 69.09,35.56 67.34,37.31 65.91,37.31 D40.A
N$8
  Top 0.127: D41.C 68.45,35.08 67.02,35.08 66.39,35.72 64.96,35.72 62.74,33.5 U$7.4 62.74,33.18 60.52,30.96 R8.1
N$9
  Top 0.127: 83.22,34.29 82.42,33.5 U$9.4 | 83.22,34.29 84.65,35.72 86.07,35.72 86.71,35.08 88.14,35.08 D43.C | 83.22,34.29 83.22,29.84 R10.1
N$10
  Top 0.127: 104.49,33.81 102.43,33.81 102.11,33.5 U$11.4 | 104.49,33.81 105.12,33.81 106.23,34.92 107.82,34.92 D45.C | 104.49,33.81 R14.1
N$11  (via drill 0.25)
  Top 0.127: v127.03,34.92 128.14,34.92 D47.C | 122.43,33.18 121.95,33.18 121.79,33.34 U$13.4 | 122.43,33.18 v122.9,33.18 | 122.43,33.18 120.49,35.12 118.02,35.12 115.92,33.02 115.92,29.84 R39.1
  Bottom 0.127: v127.03,34.92 124.65,34.92 v122.9,33.18
N$12  (via drill 0.25)
  Top 0.127: v146.4,35.08 147.19,35.08 D49.C | 143.06,35.08 v143.86,35.08 | 143.06,35.08 143.1,35.12 136.94,35.12 135.6,33.78 135.6,29.84 R43.1 | 143.06,35.08 142.84,34.86 141.48,33.5 U$15.4
  Bottom 0.127: v143.86,35.08 v146.4,35.08
N$13
  Top 0.127: 99.68,33.92 99.57,33.81 U$11.2 99.57,33.18 | 99.68,33.92 100.68,34.92 105.28,34.92 D44.C | R13.1 93.06,29.84 93.69,30.48 93.69,30.64 95.06,32 96.01,32 97.03,33.02 97.03,34.04 98.04,35.05 98.81,35.05 99.68,34.18 99.68,33.92
N$14
  Top 0.127: U$12.3 105.28,33.34 105.28,33.5 106.23,34.45 108.3,34.45 108.46,34.61 108.46,36.67 107.82,37.31 D45.A
N$15
  Top 0.127: U$10.3 85.6,33.34 85.6,33.5 86.23,34.13 88.77,34.13 89.09,34.45 89.09,36.35 88.14,37.31 D43.A
N$16
  Top 0.127: D42.C 85.6,34.61 84.33,33.34 84.33,29.05 83.85,28.57 79.88,28.57 | 79.88,28.57 77.15,28.57 75.88,29.84 R9.1 | 79.88,28.57 U$9.2
N$17  (via drill 0.25)
  Top 0.127: R1.1 137.51,19.21 140.37,19.21 142.37,17.21 142.37,14.1 D36.C 142.11,13.81 143.86,12.06 143.86,5.87 142.75,4.76 140.78,4.76 v140.72,4.83 | 133.86,9.84 U$3.2 v133.86,11.68
  Route2 0.127: v140.72,4.83 137.16,4.83 133.86,8.13 v133.86,11.68
N$18
  pour Top (no thermals): 100.58,12.19 100.33,11.94 100.33,9.14 99.31,8.13 99.31,7.11 99.31,5.59 99.82,5.08 100.84,5.08 101.6,5.08 102.11,5.59 102.36,5.84 102.36,10.16 102.36,11.68 102.11,11.94 101.85,12.19
N$19
  Top 0.127: U$4.3 139.41,17.3 139.41,16.19 139.1,15.88 139.1,14.76 139.57,14.29 139.57,12.22 138.94,11.59 D37.A
N$20
  Top 0.127: R34.1 28.45,32.34 28.64,32.24 D33.P$1
N$21
  pour Top (no thermals): 98.04,12.45 98.55,12.45 98.81,12.19 98.81,5.84 97.79,4.83 96.01,4.83 95.76,5.08 95.76,6.1 98.04,8.38
N$22
  Top 0.127: JMP1.2 103.7,20 96.55,20 94.65,21.91 94.65,23.18 94.96,23.5 96.55,23.5 96.71,23.65 102.43,23.65 U9.7
N$23
  Top 0.127: JMP2.2 105.6,26.35 107.51,26.35 108.14,26.99 108.14,29.21 107.19,30.16 106.71,30.16 106.39,30.48 101.95,30.48 101.63,30.16 101.63,24.92 101.95,24.61 102.43,24.61 U9.6
N$24
  Top 0.127: JMP3.2 103.7,30.16 102.11,30.16 101.95,30 101.95,26.51 102.43,26.04 102.43,25.24 U9.5
N$25
  Top 0.127: JMP4.2 64.96,20 57.82,20 55.91,21.91 55.91,23.18 56.23,23.5 57.82,23.5 57.98,23.65 63.69,23.65 U10.7
N$26
  Top 0.127: JMP5.2 66.87,26.35 68.45,26.35 69.41,27.3 69.41,29.21 68.14,30.48 63.21,30.48 62.9,30.16 62.9,24.92 63.21,24.61 63.69,24.61 U10.6
N$27
  Top 0.127: U$4.6 141,15.56 141,12.7 142.11,11.59 D36.A
N$28
  Top 0.127: D34.C 122.43,18.26 121.63,19.05 R20.1
  Top 0.203: R20.1 119.57,17.85 118.62,16.91 118.62,14.23 117.64,13.25 115.79,13.25 115.44,13.59 U$1.2
N$29
  Top 0.127: U$2.6 121.32,15.56 121.32,12.7 122.43,11.59 D34.A
N$30  (via drill 0.25)
  Top 0.127: v125.6,31.75 125.6,32.54 U$14.3 | v131.32,30.64 131.32,34.13 128.14,37.31 D47.A
  Bottom 0.127: v125.6,31.75 126.71,30.64 v131.32,30.64
N$31
  Top 0.127: 122.75,32.07 125.6,34.92 D46.C | 122.75,32.07 R38.1 | 122.75,32.07 120.36,32.07 119.89,32.54 119.89,32.7 119.25,33.34 U$13.2
N$32
  Top 0.127: D49.A 147.19,36.51 144.65,33.97 144.65,33.34 U$16.3
N$33
  Top 0.127: D48.C 144.65,34.45 142.43,32.23 142.43,31.72 | 142.43,31.72 R42.1 | 142.43,31.72 139.79,31.72 138.94,32.58 U$15.2
N$34
  Top 0.127: U$10.6 86.87,31.59 85.6,32.86 85.28,32.86 85.12,33.02 85.12,33.66 85.92,34.45 88.61,34.45 88.77,34.61 88.77,35.56 87.03,37.31 85.6,37.31 D42.A
N$35
  Top 0.127: R11.2 73.37,33.02 74.64,31.75 75.69,31.75 77.22,33.27 77.22,34.54 78.52,35.85 78.74,35.85 78.74,36.32 80.52,38.1 80.52,41.27 81.79,42.55 D27.P$1
N$36
  Top 0.127: U$6.6 47.66,31.59 47.66,32.07 49.72,34.13 49.72,37.47 49.24,37.94 46.7,37.94 46.23,37.47 D38.A
N$37
  Top 0.127: D38.C 46.23,34.13 44.96,32.86 44.96,29.05 43.47,27.56 40.51,27.56 | 40.51,27.56 38.55,27.56 37.02,29.08 R5.1 | 40.51,27.56 U$5.2
N$38
  Top 0.127: D40.C 65.91,34.61 61.47,30.16 61.47,29.05 60.99,28.57 54.8,28.57 R7.1 53.53,30.67 54.36,31.5 55.63,31.5 56.27,32.14 56.27,32.37 57.66,33.75 57.66,34.54 57.91,34.8 59.69,34.8 60.2,34.29 U$7.2 60.2,33.34
N$39
  Top 0.127: U$8.3 65.91,33.34 65.91,33.5 66.55,34.13 69.09,34.13 69.41,34.45 69.41,36.35 68.45,37.31 D41.A
N$40
  Top 0.127: R12.1 74.96,36.2 73.85,35.08 72.58,35.08 71.15,36.51 71.15,43.02 74.96,46.83 79.41,46.83 81.79,44.45 D28.P$1
N$41
  Top 0.127: U$12.6 106.71,31.59 106.71,31.72 108.78,33.78 108.78,37.47 108.3,37.94 105.76,37.94 105.28,37.47 D44.A
N$42
  Top 0.127: R30.2 72.26,18.57 73.06,18.57 74.64,16.99 U6.P4
N$43
  Top 0.127: R28.2 49.4,18.57 50.83,18.57 52.42,16.99 U7.P4
N$44
  pour Top (no thermals): 77.22,8.13 77.22,6.1 77.22,5.84 77.72,5.33 78.99,5.33 79.25,5.59 79.25,6.35 79.25,11.68 78.99,11.94 78.49,11.94 78.49,9.65 78.49,9.14 77.47,8.13
N$45
  pour Top (no thermals): 75.69,11.94 75.44,11.68 75.44,8.89 75.44,8.38 74.42,7.37 74.42,7.11 74.42,5.84 74.68,5.59 74.93,5.33 75.95,5.33 76.45,5.84 76.45,8.89 76.2,9.14 76.2,11.68 75.95,11.94
N$46
  pour Top (no thermals): 51.82,7.62 51.82,5.33 53.34,5.33 53.59,5.59 53.85,5.84 53.85,8.38 54.1,8.64 54.1,11.94 53.85,12.19 53.59,12.19 53.34,11.94 53.34,9.91 51.82,8.38
N$47
  pour Top (no thermals): 54.36,7.62 54.36,5.84 55.12,5.08 56.39,5.08 57.4,6.1 57.4,9.4 57.4,11.94 57.15,12.19 56.39,12.19 56.13,11.94 56.13,11.43 56.13,9.91 56.39,9.65 56.39,8.64 55.63,7.87 55.37,7.62
N$48
  Top 0.127: JMP6.2 64.96,30.16 63.37,30.16 63.21,30 63.21,26.51 63.69,26.04 63.69,25.24 U10.5
N$49
  Top 0.127: R22.2 109.25,15.88 108.14,16.99 106.87,16.99 104.74,14.86 104.74,5.11 106.52,3.33 114.17,3.33 114.33,3.49 114.33,5.56 113.54,6.35 D19.P$1
N$50
  Top 0.127: D20.P$1 112.93,3.94 106.9,3.94 105.32,5.52 105.32,12.26 106.87,13.81 108.14,13.81 109.25,12.7 R23.1
N$51
  Top 0.127: D17.P$1 132.36,6.35 131.44,7.26 131.44,11.56 134.49,14.61 134.49,16.19 134.18,16.51 132.27,16.51 129.09,13.34 R3.2
N$52
  Top 0.127: D18.P$1 125.57,4.45 124.75,5.27 124.75,12 127.19,14.45 R4.1
N$53
  Top 0.127: R25.1 33.85,34.45 32.07,36.23 32.07,43.78 34.8,46.51 40.35,46.51 42.42,44.45 D22.P$1
N$54
  Top 0.127: R24.2 39.24,36.2 41.15,38.1 41.15,41.27 42.42,42.55 D21.P$1
N$55
  Top 0.127: R37.1 53.53,34.45 51.47,36.51 51.47,43.02 55.28,46.83 59.72,46.83 62.1,44.45 D24.P$1
N$56
  Top 0.127: R36.2 56.45,37.21 59.94,37.21 60.83,38.1 60.83,41.27 62.1,42.55 D23.P$1
N$57
  Top 0.127: R15.2 95.12,33.02 100.2,38.1 100.2,41.27 101.47,42.55 D25.P$1
N$58
  Top 0.127: R16.1 92.9,36.67 90.84,38.73 90.84,43.02 94.65,46.83 99.09,46.83 101.47,44.45 D26.P$1
N$59  (via drill 0.25)
  Top 0.127: v127.03,31.59 127.03,30.96 U$14.6 | v126.71,36.51 126.4,36.51 125.6,37.31 D46.A
  Bottom 0.127: v127.03,31.59 127.03,34.29 127.51,34.77 127.51,35.72 v126.71,36.51
N$60
  Top 0.127: R41.1 112.11,33.02 112.11,34.61 112.9,35.4 112.9,36.99 113.86,37.94 119.73,37.94 119.89,38.1 119.89,41.27 121.16,42.55 D30.P$1
N$61
  Top 0.127: R40.2 113.7,36.2 113.7,34.61 112.9,33.81 112.9,32.23 112.59,31.91 111.32,31.91 110.52,32.7 110.52,43.02 114.33,46.83 118.78,46.83 121.16,44.45 D29.P$1
N$62
  Top 0.127: U$16.6 146.08,31.59 146.56,31.59 147.83,32.86 147.83,37.78 147.67,37.94 145.13,37.94 144.65,37.47 D48.A
N$63
  Top 0.127: R45.1 132.43,33.02 134.49,35.08 135.38,35.08 138.24,37.94 139.41,37.94 139.57,38.1 139.57,41.27 140.84,42.55 D32.P$1
N$64  (via drill 0.25)
  Top 0.127: v134.18,37.62 R44.2 | v139.25,42.7 141,44.45 D31.P$1
  Bottom 0.127: v139.25,42.7 v134.18,37.62
N$65
  pour Top: 2.12,19.39 arc-45 7.42,21.59 22.84,21.59 arc-45 24.64,20.85 24.64,0 9.96,0 arc-45 4.66,2.2 3.97,2.88 arc-45 2.12,7.36
ONKL
  Top 0.127: R27.1 60.52,22.54 60.83,22.23 C20.1 60.83,22.07 63.85,22.07 | 64.33,27.3 64.33,29.21 JMP6.3 | 63.85,22.07 63.85,21.27 64.17,20.95 JMP4.3 | 63.85,22.07 63.85,22.86 | 63.85,22.86 63.85,23.02 U10.8 | 64.33,27.3 64.33,25.56 64.48,25.4 64.48,23.5 63.85,22.86 | 64.33,27.3 JMP5.3
RESET
  Top 0.127: U5.P12 153.54,15.72 155.13,15.72 155.77,15.08 S2.P$4 155.92,14.92 155.92,7.94 S2.P$3 155.77,7.94 154.65,9.05 151.64,9.05 R35.1
SCL3.3  (via drill 0.25)
  Top 0.127: v154.97,21.91 156.08,21.91 CN19.P$2 | v154.18,26.99 154.18,27.78 152.27,29.69 | 152.27,29.69 149.57,32.38 R17.1 | U3.3 154.81,34.45 152.27,31.91 152.27,29.69
  Bottom 0.127: v154.97,21.91 154.97,26.19 v154.18,26.99
SCL5  (via drill 0.25)
  Top 0.127: v69.09,23.81 68.14,23.81 U10.2 | v103.7,23.81 106.71,23.81 U9.2 | R32.1 154.81,41.59 U3.6 v154.81,39.69 | v151.96,14.92 151.96,15.72 U5.P9 | v148.78,11.75 148.15,11.75 U8.P$5
  Route2 0.127: v148.78,11.75 v151.96,14.92
  Bottom 0.127: v69.09,23.81 v103.7,23.81 143.86,23.81 146.37,21.3 150.65,21.3 152.59,19.37 155.61,19.37 | v154.81,39.69 154.81,28.1 155.61,27.3 155.61,19.37 | 155.61,19.37 155.61,17.94 152.59,14.92 v151.96,14.92
SDA3.3  (via drill 0.25)
  Top 0.127: v156.08,20.8 CN19.P$1 | v156.08,27.46 156.08,30.96 154.65,32.38 | U3.4 156.08,33.81 154.65,32.38 | 154.65,32.38 R19.1
  Bottom 0.127: v156.08,27.46 v156.08,20.8
SDA5  (via drill 0.25)
  Top 0.127: U3.5 156.08,40.8 157.67,40.8 159.89,38.58 R33.1 v159.89,37.31 | 152.43,14.45 152.43,11.59 151,10.16 150.84,10.16 150.53,9.84 150.53,8.57 150.84,8.26 152.43,8.26 152.75,7.94 152.75,6.67 152.43,6.35 150.84,6.35 147.03,10.16 147.03,12.22 U8.P$6 | 152.43,14.45 152.43,15.72 U5.P10 | 152.43,14.45 v152.59,14.45 | 108.14,20.8 108.14,21.75 106.87,23.02 U9.1 | 108.14,20.8 108.14,20.64 107.19,19.68 85.47,19.68 v85.34,19.56 | U10.1 68.14,23.02 68.14,22.38 69.82,22.38 v69.85,22.35 | 108.14,20.8 v113.86,20.8
  Route2 0.127: v85.34,19.56 75.95,19.56 73.15,22.35 v69.85,22.35
  Bottom 0.127: v159.89,37.31 159.89,27.15 156.56,23.81 156.56,18.41 154.97,16.83 | v152.59,14.45 154.97,16.83 | 154.97,16.83 155.45,16.35 155.45,16.03 153.07,13.65 120.49,13.65 113.86,20.29 v113.86,20.8
UOY
  Top 0.127: R26.1 99.25,22.54 99.57,22.23 C19.1 99.57,22.07 102.58,22.07 | 103.06,27.3 103.06,29.21 JMP3.3 | 102.58,22.07 102.58,21.27 102.9,20.95 JMP1.3 | 102.58,22.07 102.58,22.86 | 102.58,22.86 102.58,23.02 U9.8 | 103.06,27.3 103.06,25.56 103.22,25.4 103.22,23.5 102.58,22.86 | 103.06,27.3 JMP2.3
VAL_1
  Top 0.381: R22.1 107.66,15.88 108.3,15.24 108.3,15.08 109.41,13.97 111.79,13.97 115.6,10.16 U$1.7 115.44,10 116.55,10 U$1.8 116.71,9.84 117.03,9.53 D1.C$1 119.57,9.37 119.89,9.05
  pour Top (no thermals): 118.62,10.41 118.62,5.84 119.38,5.08 119.63,5.08 120.4,5.08 120.65,5.33 120.65,10.16 120.4,10.41
VAL_2
  Top 0.381: U$1.6 114.17,10 112.9,10 U$1.5 112.74,10 111.79,10 110.68,11.11 107.51,11.11 | CN3.P$1 107.03,6.51 | 107.03,9.53 D2.C$1 107.03,9.68 107.51,10.16 107.51,11.11 | 107.51,11.11 R23.2
  pour Top (no thermals): 106.17,10.41 106.17,5.84 106.68,5.33 106.93,5.33 107.44,5.33 107.7,5.59 107.95,5.84 107.95,10.16 107.7,10.41
VAL_3
  Top 0.381: U$3.7 133.86,15.56 132.59,15.56 U$3.8 132.59,14.29 129.73,11.43 127.19,11.43 | CN2.P$1 126.71,6.51 | 126.71,9.53 D5.C$1 126.71,9.68 127.19,10.16 127.19,11.43 | 127.19,11.43 R3.1
  pour Top (no thermals): 125.48,10.67 127.25,10.67 127.51,10.41 127.51,5.59 125.98,5.59 125.73,5.84 125.48,6.1
VAL_4
  Top 0.381: CN4.P$1 139.41,6.51 | 139.41,9.53 D6.C$1 139.25,9.68 136.4,12.54 U$3.5 136.4,15.56 135.6,15.56 | 135.6,15.56 135.13,15.56 U$3.6 | R4.2 130.37,15.24 132.11,16.99 134.33,16.99 135.6,15.72 135.6,15.56
  pour Top (no thermals): 137.92,10.16 137.92,6.1 138.68,5.33 140.46,5.33 140.46,10.41 137.92,10.41
VAL_5
  Top 0.381: D7.C$1 38.93,39.37 39.24,39.05 U$5.8 39.4,39.05 40.51,39.05 U$5.7 | R24.1 34,36.2 34,36.67 36.54,39.21 D7.C$1 | 36.07,38.89 D7.C$1
  pour Top (no thermals): 35.31,43.43 35.31,39.62 36.07,38.86 36.32,38.86 37.34,38.86 37.59,39.12 37.59,43.18 37.34,43.43 37.08,43.43
VAL_6
  Top 0.381: 48.93,42.39 CN6.P$1 48.61,42.55 47.99,43.16 47.02,44.13 45.43,44.13 43.53,42.23 43.53,39.69 43.05,39.21 U$5.5 43.05,39.05 42.58,39.05 | 48.93,39.37 D8.C$1 | 42.58,39.05 41.78,39.05 U$5.6 | R25.2 36.7,33.02 42.58,38.89 42.58,39.05
  pour Top (no thermals): 48.01,39.37 48.01,43.43 48.26,43.69 49.78,43.69 50.29,43.18 50.29,38.86 48.51,38.86
VAL_7
  Top 0.381: D3.C$1 58.61,39.37 58.93,39.05 U$7.8 59.09,39.05 60.2,39.05 U$7.7 | R36.1 53.69,36.2 53.69,36.83 56.07,39.21 D3.C$1 | 55.75,39.05 D3.C$1
  pour Top (no thermals): 55.12,42.42 55.12,39.37 55.37,39.12 55.63,38.86 56.9,38.86 57.4,39.37 57.4,43.18 57.15,43.43 56.9,43.43 55.37,43.43 55.12,43.18
VAL_8
  Top 0.381: CN8.P$1 68.73,42.27 | R37.2 56.39,33.02 57.15,33.78 57.15,36.07 57.91,36.83 60.2,36.83 61.47,38.1 U$7.6 61.47,39.05 62.74,39.05 U$7.5 62.74,39.21 63.21,39.69 63.21,42.23 65.12,44.13 66.87,44.13 67.66,43.34 68.58,42.55
  Top 2.54: D4.C$1 68.73,42.27 68.58,42.42 68.58,42.55
VAL_9
  Top 0.381: U$9.7 79.88,39.05 78.61,39.05 U$9.8 78.45,39.05 76.87,39.05 D9.C$1 76.23,38.26 76.23,35.4 75.12,34.29 R11.1
  pour Top (no thermals): 74.68,43.18 74.68,41.91 74.68,41.66 74.93,41.4 74.93,38.86 75.18,38.61 76.71,38.61 76.71,43.43 76.45,43.69 74.93,43.69 74.68,43.43
VAL_10  (via drill 0.25)
  Top 0.127: 82.42,39.05 81.15,39.05 U$9.6 | 82.42,39.05 82.42,41.27 83.85,42.7 83.85,43.02 84.96,44.13 86.23,44.13 87.19,43.18 88.27,42.55 | 82.42,39.05 U$9.5 | v74.64,37.47 73.37,36.2 R12.2 | CN11.P$1 88.42,42.27
  Top 2.54: D10.C$1 88.42,42.27 88.27,42.42 88.27,42.55
  Bottom 0.127: v74.64,37.47 83.06,37.47 CN11.P$1
VAL_11
  Top 0.381: R15.1 93.06,33.02 93.69,33.66 93.69,33.81 94.81,34.92 95.44,34.92 99.41,38.89 U$11.7 99.57,39.05 98.3,39.05 U$11.8 98.14,39.05 96.55,39.05 D13.C$1
  pour Top (no thermals): 94.23,42.93 94.23,41.66 94.74,41.15 94.74,38.61 95,38.35 95.5,38.35 96.27,38.35 96.77,38.86 96.77,42.93 96.27,43.43 94.74,43.43
VAL_12  (via drill 0.25)
  Top 0.381: U$11.6 100.84,39.05 102.11,39.05 U$11.5 102.11,41.12 103.38,42.39 103.38,43.02 104.49,44.13 106.08,44.13 107.66,42.55 CN12.P$1 107.98,42.39 | 107.98,39.37 D14.C$1 | v96.08,37.47 R16.2
  Bottom 0.381: v96.08,37.47 102.74,37.47 CN12.P$1
  pour Top (no thermals): 106.93,43.18 106.93,42.16 107.44,41.66 107.44,38.86 107.7,38.61 109.47,38.61 109.47,39.12 109.73,39.37 109.73,43.18 109.22,43.69 107.19,43.69 106.93,43.43
VAL_13
  Top 0.381: D15.C$1 117.67,39.37 117.98,39.05 U$13.8 118.14,39.05 119.25,39.05 U$13.7 | D15.C$1 114.65,39.37 112.11,36.83 112.11,36.2 R40.1 | 114.81,39.53 D15.C$1
  pour Top (no thermals): 114.05,42.42 114.05,41.91 114.05,41.66 114.3,41.4 114.3,39.12 114.55,38.86 115.82,38.86 115.82,39.37 116.08,39.62 116.08,43.18 115.57,43.69 114.3,43.69 114.05,43.43
VAL_14  (via drill 0.25)
  Top 0.381: v129.41,39.37 D16.C$1 | 121.32,39.05 121.79,39.05 U$13.5 121.95,39.05 122.27,39.37 v122.9,39.37 | 121.32,39.05 120.52,39.05 U$13.6 | R41.2 115.28,33.02 119.73,37.47 119.89,37.47 121.32,38.89 121.32,39.05
  Bottom 0.381: v122.9,39.37 v129.41,39.37
  pour Top (no thermals): 127,43.69 127,38.61 127.25,38.35 129.54,38.35 129.79,38.61 129.79,43.69
VAL_15
  Top 0.381: U$15.7 138.94,39.05 137.83,39.05 U$15.8 137.67,39.05 137.35,39.37 D11.C$1 134.81,39.21 132.43,36.83 132.43,36.2 R44.1 132.27,36.51
  pour Top (no thermals): 133.86,43.69 133.86,39.12 134.11,38.86 134.37,38.86 135.64,38.86 136.14,39.37 136.14,39.88 136.14,43.43 135.89,43.69
VAL_16
  Top 0.381: 147.35,42.39 CN16.P$1 147.03,42.55 145.45,44.13 143.86,44.13 141.95,42.23 141.95,39.69 141.48,39.21 U$15.5 141.48,39.05 141,39.05 | 147.35,39.37 D12.C$1 | 141,39.05 140.21,39.05 U$15.6 | R45.2 134.17,33.24 138.4,37.47 139.57,37.47 141,38.89 141,39.05
  pour Top (no thermals): 146.56,43.18 146.56,41.15 146.81,40.89 146.81,38.61 148.34,38.61 148.34,43.18 148.08,43.43 146.81,43.43

## Text on the board
tNames: Rev 1.1 | 11/20/18 | VALVE CONTROL BOARD | Designer: Nathan Bane | GND | Motor 1 | Motor 2 | Motor 3 | +